# EAGLE design SMA-Q2 replacement board v2.3different (EAGLE 8.6.0)
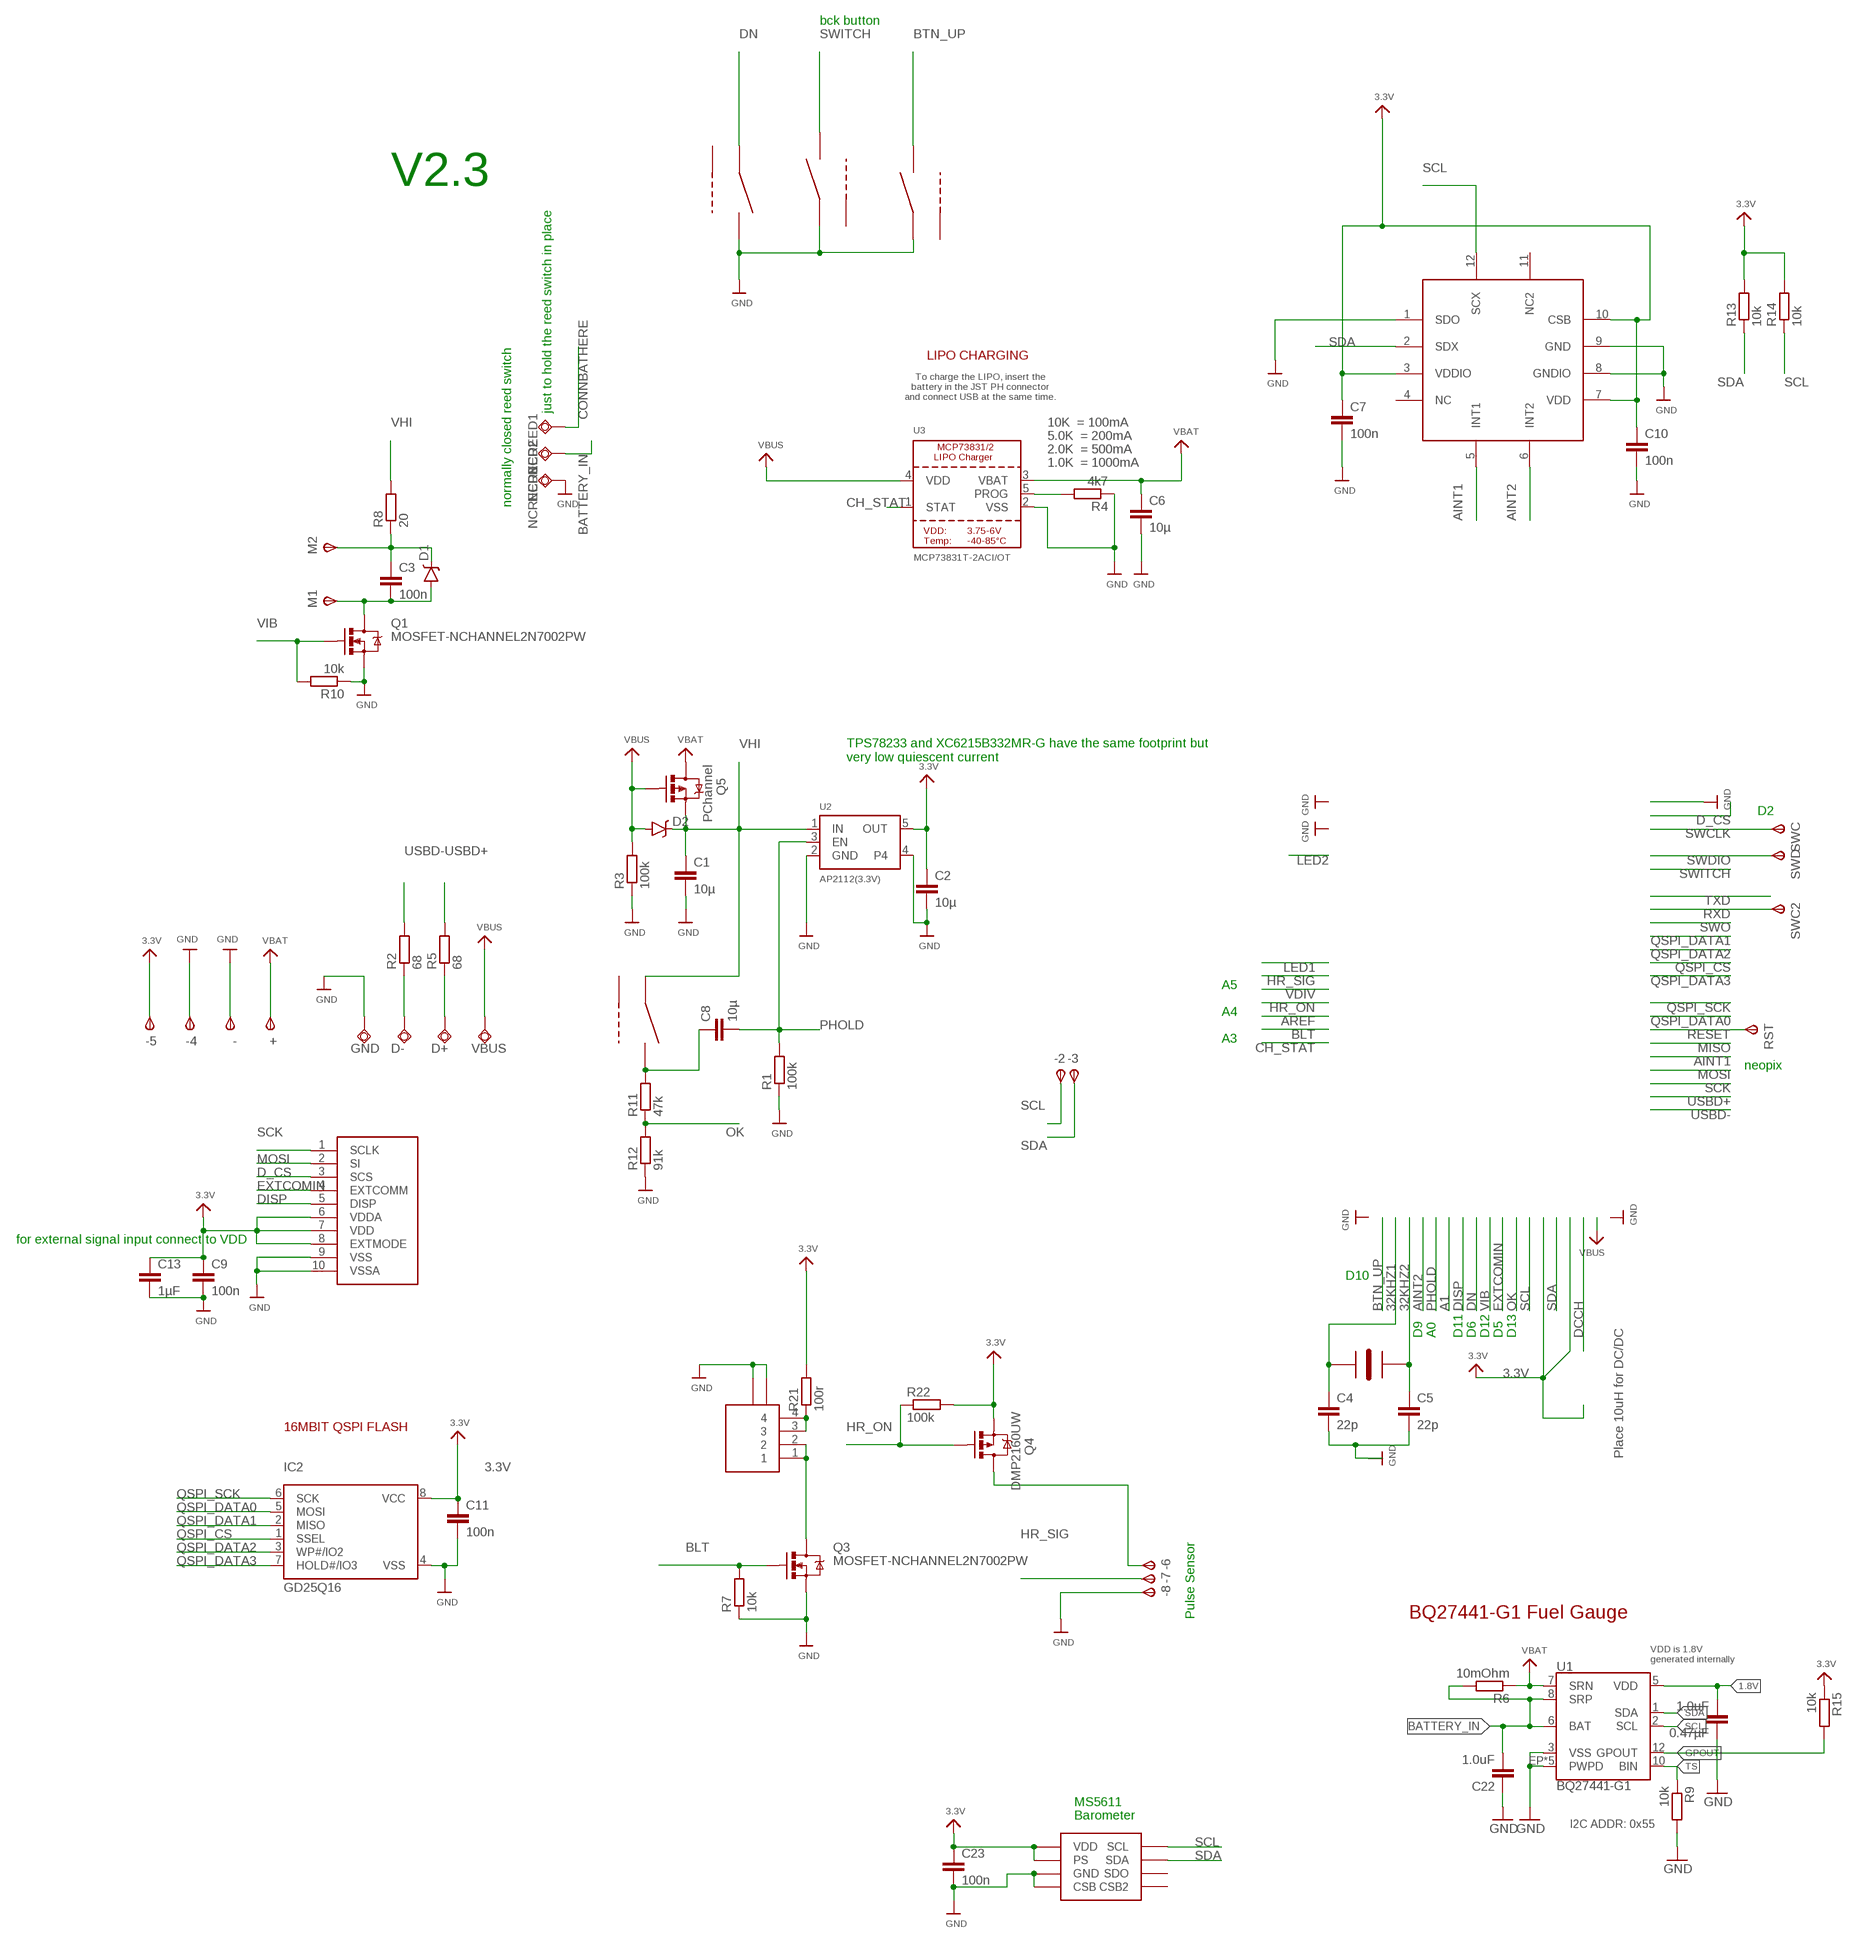
[diagram p0: schematic, sheet 1, part 1 of 2]
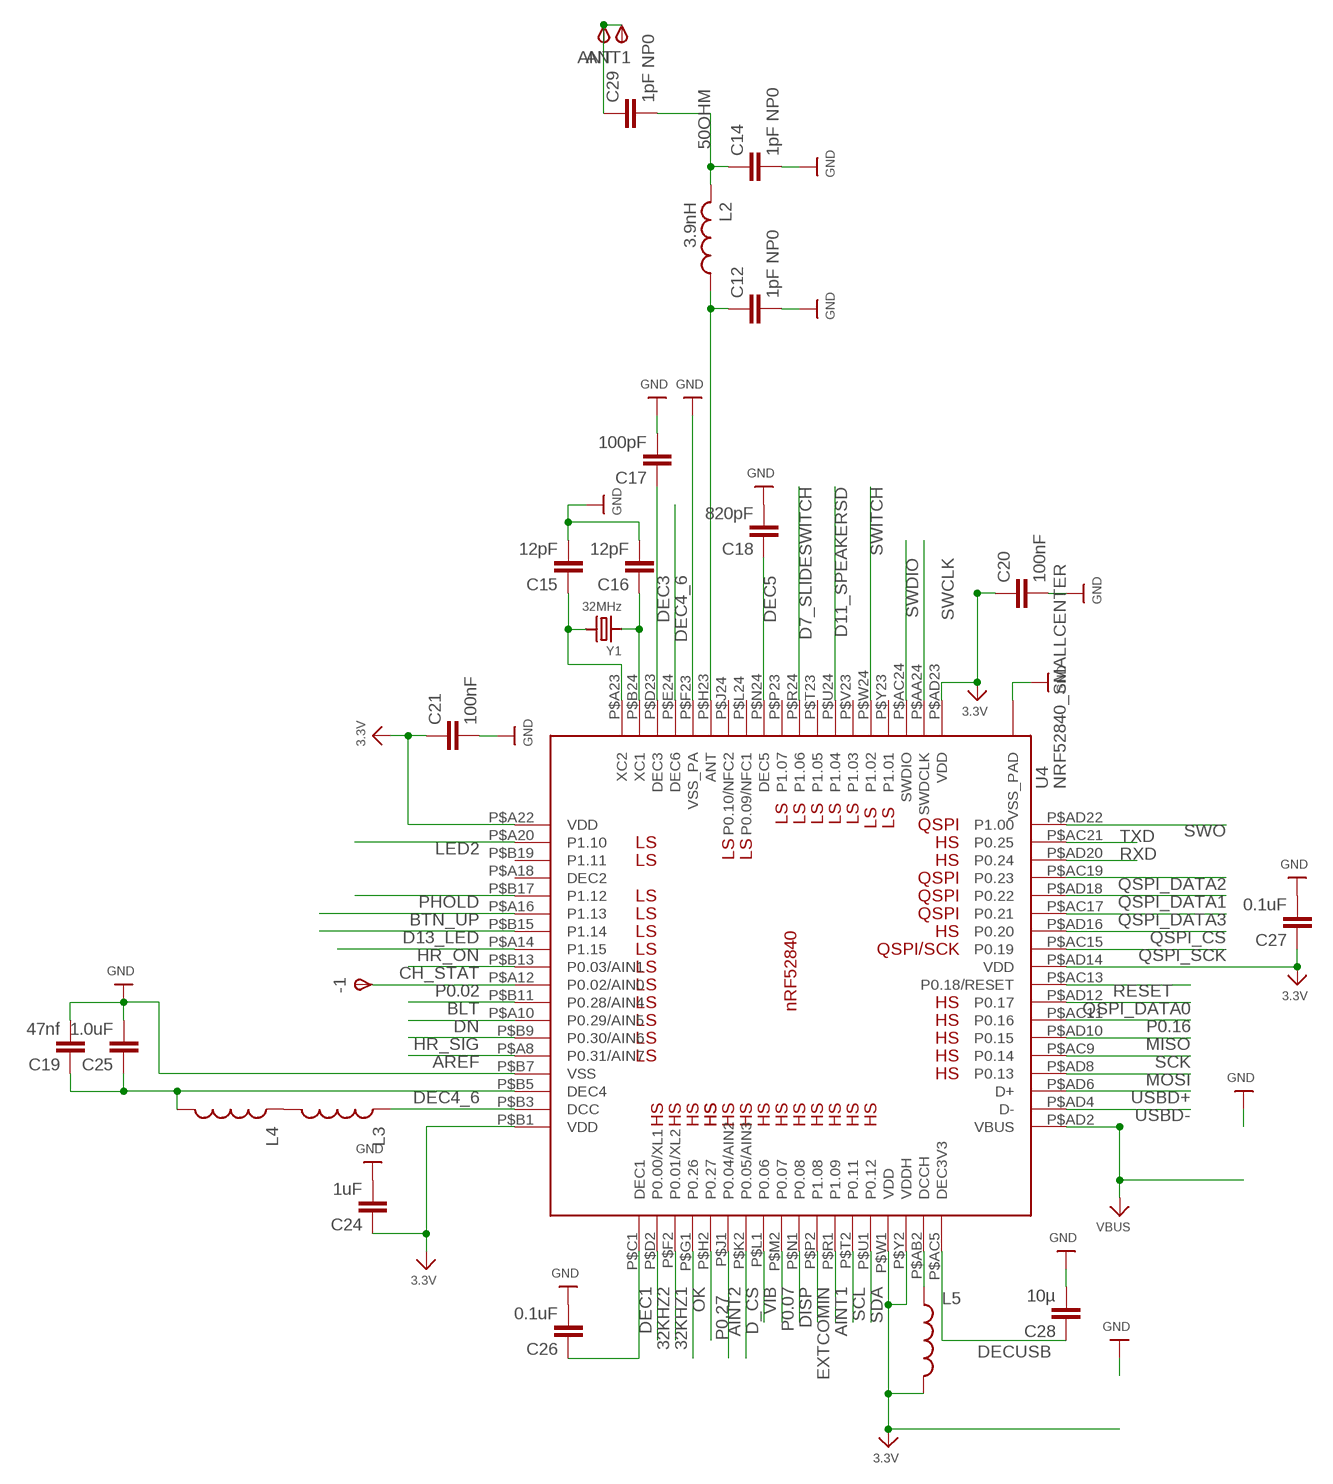
[diagram p1: schematic, sheet 1, part 2 of 2]

## Parts
0.47µF  1.0uF  CAPACITOR_0603_N  [RESC0603_N]
+  TPSTP09R  [TP09R]
-  TPSTP09R  [TP09R]
-1  TPSTP09R  [TP09R]
-2  TPSTP09R  [TP09R]
-3  TPSTP09R  [TP09R]
-4  TPSTP09R  [TP09R]
-5  TPSTP09R  [TP09R]
-6  TPSTP09R  [TP09R]
-7  TPSTP09R  [TP09R]
-8  TPSTP09R  [TP09R]
ANT  TPSTP19SQ  [TP19SQ]
ANT1  TPSTP19SQ  [TP19SQ]
C1  10µ  C-EUC0603  [C0603]
C2  10µ  C-EUC0603  [C0603]
C3  100n  C-EUC0402  [C0402]
C4  22p  C-EUC0402  [C0402]
C5  22p  C-EUC0402  [C0402]
C6  10µ  C-EUC0603  [C0603]
C7  100n  C-EUC0402  [C0402]
C8  10µ  C-EUC0603  [C0603]
C9  100n  C-EUC0402  [C0402]
C10  100n  C-EUC0402  [C0402]
C11  100n  C-EUC0402  [C0402]
C12  1pF NP0  CAPACITOR_0402_N  [RESC0402_N]
C13  1µF  C-EUC0402  [C0402]
C14  1pF NP0  CAPACITOR_0402_N  [RESC0402_N]
C15  12pF  CAPACITOR_0402_N  [RESC0402_N]
C16  12pF  CAPACITOR_0402_N  [RESC0402_N]
C17  100pF  CAPACITOR_0402_N  [RESC0402_N]
C18  820pF  CAPACITOR_0402_N  [RESC0402_N]
C19  47nf  CAPACITOR_0603_N  [RESC0603_N]
C20  100nF  CAPACITOR_0402_N  [RESC0402_N]
C21  100nF  CAPACITOR_0402_N  [RESC0402_N]
C22  1.0uF  CAPACITOR_0603_N  [RESC0603_N]
C23  100n  C-EUC0402  [C0402]
C24  1uF  CAPACITOR_0603_N  [RESC0603_N]
C25  1.0uF  CAPACITOR_0603_N  [RESC0603_N]
C26  0.1uF  CAPACITOR_0603_N  [RESC0603_N]
C27  0.1uF  CAPACITOR_0402_N  [RESC0402_N]
C28  10µ  C-EUC0603  [C0603]
C29  1pF NP0  CAPACITOR_0402_N  [RESC0402_N]
D1  BAT20J  DIODE-SCHOTTKY-BAT20J  [SOD-323]
D2  BAT20J  DIODE-SCHOTTKY-BAT20J  [SOD-323]
D+  TPSQTP20R  [TP20R]
D-  TPSQTP20R  [TP20R]
DWN  LS12T2  [LS12T2]
DWN1  LS12T2  [LS12T2]
DWN2  LS12T2  [LS12T2]
DWN3  LS12T2  [LS12T2]
GND  TPSQTP20R  [TP20R]
IC2  GD25Q16  SPIFLASH_8PINUX  [USON8]
L2  3.9nH  INDUCTOR_0402_N  [RESC0402_N]
L3  INDUCTOR30OHM,1.8A  [0603]
L4  INDUCTOR0402  [C0402]
L5  INDUCTOR30OHM,1.8A  [0603]
M1  TPSTP09R  [TP09R]
M2  TPSTP09R  [TP09R]
NCREED1  TPSQTP20R  [TP20R]
NCREED2  TPSQTP20R  [TP20R]
NCREED3  TPSQTP20R  [TP20R]
Q1  MOSFET-NCHANNEL2N7002PW  [SOT323]
Q3  MOSFET-NCHANNEL2N7002PW  [SOT323]
Q4  DMP2160UW  MOSFET-P-CHANNEL-DMP2160UW  [SOT323]
Q5  PChannel  MOSFET-P-CHANNEL-DMP2160UW  [SOT323]
R1  100k  R-EU_R0402  [R0402]
R2  68  R-EU_R0402  [R0402]
R3  100k  R-EU_R0402  [R0402]
R4  4k7  R-EU_R0402  [R0402]
R5  68  R-EU_R0402  [R0402]
R6  10mOhm  R-EU_R0402  [R0402]
R7  10k  R-EU_R0402  [R0402]
R8  20  R-EU_R0402  [R0402]
R9  10k  R-EU_R0402  [R0402]
R10  10k  R-EU_R0402  [R0402]
R11  47k  R-EU_R0402  [R0402]
R12  91k  R-EU_R0402  [R0402]
R13  10k  R-EU_R0402  [R0402]
R14  10k  R-EU_R0402  [R0402]
R15  10k  R-EU_R0402  [R0402]
R21  100r  R-EU_R0402  [R0402]
R22  100k  R-EU_R0402  [R0402]
RST  TPSTP09R  [TP09R]
SWC  TPSTP09R  [TP09R]
SWC2  TPSTP09R  [TP09R]
SWD  TPSTP09R  [TP09R]
U1  BQ27441-G1  [PDSO-N12]
U2  AP2112(3.3V)  VREG_SOT23-5  [SOT23-5]
U3  MCP73831T-2ACI/OT  MCP73831/2  [SOT23-5]
U4  NRF52840_SMALLCENTER  [AQFN50P700X800X85_HS-74N_SMALLCENTER]
U$2  SHARP_MEM_DISP  [Y5BW]
U$6  Y5B-4PIN  [Y5B-4PIN]
U$7  BMA400  [BMA400]
U$45  MC5611  [MS5611]
U$81  ECX-1210  [ECX-1210]
VBUS  TPSQTP20R  [TP20R]
Y1  32MHz  CRYSTAL2.5X2.0  [CRYSTAL_2.5X2]

## Nets
1.8V: 0.47µF.2 U1.5(VDD)
3.3V [power]: -5.TP(PP) C2.1 C7.1 C9.1 C10.1 C11.1 C13.1 C20.1 C21.1 C23.1 C24.1 C27.1 IC2.8(VCC) L5.2 Q4.2(S) R13.2 R14.2 R15.1 R21.2 R22.2 U2.5(OUT) U4.P$A22(VDD) U4.P$AD14(VDD) U4.P$AD23(VDD) U4.P$B1(VDD) U4.P$W1(VDD) U4.P$Y2(VDDH) U$2.6(VDDA) U$2.7(VDD) U$2.8(EXTMODE) U$7.3(VDDIO) U$7.7(VDD) U$7.10(CSB) U$45.PS U$45.VDD
32KHZ1: C4.1 U4.P$F2(P0.01/XL2) U$81.P$1
32KHZ2: C5.1 U4.P$D2(P0.00/XL1) U$81.P$2
50OHM: C14.1 C29.2 L2.2
AINT1: U4.P$R1(P1.09) U$7.5(INT1)
AINT2: U4.P$J1(P0.04/AIN2) U$7.6(INT2)
AREF: U4.P$A8(P0.31/AIN7)
BATTERY_IN: C22.2 NCREED2.TP R6.2 U1.6(BAT) U1.8(SRP)
BLT: Q3.1(G) R7.2 U4.P$B11(P0.28/AIN4)
BTN_UP: DWN2.1 U4.P$A16(P1.13)
CH_STAT: U3.1(STAT) U4.P$B13(P0.03/AIN1)
CONNBATHERE: NCREED1.TP
D7_SLIDESWITCH: U4.P$R24(P1.06)
D11_SPEAKERSD: U4.P$U24(P1.04)
D13_LED: U4.P$B15(P1.14)
D_CS: U4.P$K2(P0.05/AIN3) U$2.3(SCS)
DEC1: C26.1 U4.P$C1(DEC1)
DEC3: C17.1 U4.P$D23(DEC3)
DEC4_6: C19.1 C25.1 L4.2 U4.P$B5(DEC4) U4.P$E24(DEC6)
DEC5: C18.1 U4.P$N24(DEC5)
DECUSB: C28.1 U4.P$AC5(DEC3V3)
DISP [power]: U4.P$N1(P0.08) U$2.5(DISP)
DN: DWN.2 U4.P$A10(P0.29/AIN5)
EXTCOMIN: U4.P$P2(P1.08) U$2.4(EXTCOMM)
GND: 0.47µF.1 -4.TP(PP) -8.TP(PP) -.TP(PP) C1.2 C2.2 C4.2 C5.2 C6.2 C7.2 C9.2 C10.2 C11.2 C12.2 C13.2 C14.2 C15.2 C16.2 C17.2 C18.2 C19.2 C20.2 C21.2 C22.1 C23.2 C24.2 C25.2 C26.2 C27.2 C28.2 DWN1.2 DWN2.2 DWN.1 GND.TP IC2.4(VSS) NCREED3.TP Q1.2(S) Q3.2(S) R1.1 R3.1 R4.1 R7.1 R9.2 R10.1 R12.1 U1.3(VSS) U1.EP1(PWPD) U1.EP2(PWPD) U1.EP3(PWPD) U1.EP4(PWPD) U1.EP(PWPD) U2.2(GND) U2.4 U3.2(VSS) U4.P$B7(VSS) U4.P$F23(VSS_PA) U4.THERMPAD(VSS_PAD) U$2.9(VSS) U$2.10(VSSA) U$6.H1 U$6.H2 U$7.1(SDO) U$7.8(GNDIO) U$7.9(GND) U$45.CSB U$45.GND
GPOUT: R15.2 U1.12(GPOUT)
HR_ON: Q4.1(G) R22.1 U4.P$A14(P1.15)
HR_SIG: -7.TP(PP) U4.P$B9(P0.30/AIN6)
LED2: U4.P$A20(P1.10)
MISO: U4.P$AD10(P0.15)
MOSI: U4.P$AD8(P0.13) U$2.2(SI)
N$1: Q3.3(D) U$6.1 U$6.2
N$2: C8.1 DWN3.1 R11.2
N$3: D-.TP R2.1
N$4: D+.TP R5.1
N$5: C12.1 L2.1 U4.P$H23(ANT)
N$6: L3.2 L4.1
N$7: L3.1 U4.P$B3(DCC)
N$8: L5.1 U4.P$AB2(DCCH)
N$9: R21.1 U$6.3 U$6.4
N$10: -6.TP(PP) Q4.3(D)
N$12: R4.2 U3.5(PROG)
N$13: C3.2 D1.A M1.TP(PP) Q1.3(D)
N$14: C3.1 D1.C M2.TP(PP) R8.1
N$22: C15.1 U4.P$A23(XC2) Y1.3
N$23: C16.1 U4.P$B24(XC1) Y1.1
OK: R11.1 R12.2 U4.P$G1(P0.26)
P0.02: -1.TP(PP) U4.P$A12(P0.02/AIN0)
P0.07: U4.P$M2(P0.07)
P0.16: U4.P$AC11(P0.16)
P0.27: U4.P$H2(P0.27)
PHOLD: C8.2 R1.2 U2.3(EN) U4.P$B17(P1.12)
QSPI_CS: IC2.1(SSEL) U4.P$AD16(P0.20)
QSPI_DATA0: IC2.5(MOSI) U4.P$AD12(P0.17)
QSPI_DATA1: IC2.2(MISO) U4.P$AD18(P0.22)
QSPI_DATA2: IC2.3(WP#/IO2) U4.P$AC19(P0.23)
QSPI_DATA3: IC2.7(HOLD#/IO3) U4.P$AC17(P0.21)
QSPI_SCK: IC2.6(SCK) U4.P$AC15(P0.19)
RESET: RST.TP(PP) U4.P$AC13(P0.18/RESET)
RF: ANT1.TP(PP) ANT.TP(PP) C29.1
RXD: SWC2.TP(PP) U4.P$AD20(P0.24)
SCK: U4.P$AC9(P0.14) U$2.1(SCLK)
SCL: -2.TP(PP) R14.1 U1.2(SCL) U4.P$T2(P0.11) U$7.12(SCX) U$45.SCL
SDA: -3.TP(PP) R13.1 U1.1(SDA) U4.P$U1(P0.12) U$7.2(SDX) U$45.SDA
SWCLK: SWC.TP(PP) U4.P$AA24(SWDCLK)
SWDIO: SWD.TP(PP) U4.P$AC24(SWDIO)
SWITCH: DWN1.1 U4.P$W24(P1.02)
SWO: U4.P$AD22(P1.00)
TS: R9.1 U1.10(BIN)
TXD: U4.P$AC21(P0.25)
USBD+: R5.2 U4.P$AD6(D+)
USBD-: R2.2 U4.P$AD4(D-)
VBAT [power]: +.TP(PP) C6.1 Q5.3(D) R6.1 U1.7(SRN) U3.3(VBAT)
VBUS [power]: D2.A Q5.1(G) R3.2 U3.4(VDD) U4.P$AD2(VBUS) VBUS.TP
VHI [power]: C1.1 D2.C DWN3.2 Q5.2(S) R8.2 U2.1(IN)
VIB: Q1.1(G) R10.2 U4.P$L1(P0.06)
Unconnected: DWN1.FRAME(FRM) DWN2.FRAME(FRM) DWN3.FRAME(FRM) DWN.FRAME(FRM) U4.P$A18(DEC2) U4.P$B19(P1.11) U4.P$J24(P0.10/NFC2) U4.P$L24(P0.09/NFC1) U4.P$P23(P1.07) U4.P$T23(P1.05) U4.P$V23(P1.03) U4.P$Y23(P1.01) U$7.4(NC) U$7.11(NC2) U$45.CSB2 U$45.SDO

## Notes on the sheet
- bck button
- V2.3
- LIPO CHARGING
- To charge the LIPO, insert the
  battery in the JST PH connector
  and connect USB at the same time.
- just to hold the reed switch in place
- 10K  = 100mA
- 5.0K  = 200mA
- 2.0K  = 500mA
- 1.0K  = 1000mA
- normally closed reed switch
- TPS78233 and XC6215B332MR-G have the same footprint but 
  very low quiescent current
- D2
- A5
- A4
- A3
- neopix
- for external signal input connect to VDD
- D10
- D9 | A0 | D11 | D6 | D12 | D5 | D13
- 16MBIT QSPI FLASH
- Place 10uH for DC/DC
- BQ27441-G1 Fuel Gauge
- Pulse Sensor
- VDD is 1.8V
  generated internally
- MS5611
- Barometer | I2C ADDR: 0x55

## Library data of the parts
0.47µF C12 C14-C22 C24-C27 C29 = Nordic_misc:CAPACITOR: Generic chip capacitor
+ - -1--8 ANT ANT1 M1 M2 RST SWC SWC2 SWD = testpad:TPS: TEST PIN
C1-C11 C13 C23 C28 = rcl:C-EU: CAPACITOR, European symbol
D1 D2 = SparkFun-DiscreteSemi:DIODE-SCHOTTKY: Schottky diodes in SFE's production catalog BAT20J 1A 23V 0.62Vf RB751 120mA 40V 0.37Vf PMEG4005EJ 0.5A 40V 0.42Vf MBRA140 1A 40V 0.5Vf B340A 3A 40V SMA; PROD_ID: DIO-11623
D+ D- GND NCREED1-NCREED3 VBUS = testpad:TPSQ: Test pad
DWN DWN1-DWN3 = LS12T2:LS12T2
IC2 = microbuilder:SPIFLASH_8PIN: SOIC8 SPI Flash Be careful with the size since SOIC8 flash comes in several 'widths' SOIC8 150 mil M25P16 - 16Mbit (2Mbit x 8) Serial Flash (75MHz SPI Bus), Supply: 2.7-3.6V Digikey: SOIC8 - M25P16-VMN6P-ND SOIC8 208 mil W25Q16BVSSIG - 16Mbit (2Mbit x 8) Serial Flash (104MHz SPI Bus), Supply: 2.7-3.6V Digikey: SOIC8 - W25Q16BVSSIG-ND
L2 = Nordic_misc:INDUCTOR: Generic chip inductor
L3 L5 = SparkFun-Passives:INDUCTOR: Inductors Basic Inductor/Choke - 0603 and 1206. Footprints are not proven and vary greatly between part numbers. INDUCTOR POWER 3.3UH 4.0A SMD 0.197" L x 0.197" W x 0.177" H (5.00mm x 5.00mm x 4.50mm); PROD_ID: RES-07859
L4 = SparkFun-Passives:INDUCTOR: Inductors Basic Inductor/Choke - 0603 and 1206. Footprints are not proven and vary greatly between part numbers. INDUCTOR POWER 3.3UH 4.0A SMD 0.197" L x 0.197" W x 0.177" H (5.00mm x 5.00mm x 4.50mm)
Q1 Q3 = SparkFun-DiscreteSemi:MOSFET-NCHANNEL: Common NMOSFET Parts MFG P/N Store ID Prod ID FDD8780 TRANS-09984 SI7820DN TRANS-11055 FDS6630A IC-08089 2N7002PW TRANS-11151 FQP30N06L COM-10213 TRANS-10060 BSS123LT1G TRANS-08345 BSS138 TRANS-00830 BS170 2N7000; PROD_ID: TRANS-11151
Q4 Q5 = TSEM_R2A:MOSFET-P-CHANNEL: MOSFET P Channel; FARNELL_OC: 1858672
R1-R15 R21 R22 = rcl:R-EU_: RESISTOR, European symbol
U1 = battery-management-temp:BQ27441-G1; PROD_ID: IC-13220
U2 = microbuilder:VREG_SOT23-5: SOT23-5 Fixed Voltage Regulators Part Current Out V Out V In V Dropout θJA (°C/W) TJ (°C) Digikey Part No. ADP121 150mA 3.3V 3.4-5.5V 0.09V @ 150mA -- -- ADP121-AUJZ33R7CT-ND ADP121 150mA 3.0V 3.1-5.5V 0.09V @ 150mA -- -- ADP121-AUJZ30R7CT-ND ADP122 300mA 3.3V 3.4-5.5V 0.085V @ 300mA -- -- ADP122AUJZ-3.3-R7CT-ND ADP1712 300mA 3.3V 3.5-5.5V 0.17V @ 300mA -- -- ADP1712AUJZ-3.3-R7TR-ND AP7311 (Low Cost) 150mA 3.3V 3.5-6V 0.15V @ 150mA -- -- AP7311-33WG-7DICT-ND LD39015M18R 150mA 1.8V 1.9V-5.5V 0.08V @ 100mA -- -- 497-6977-1-ND LP2985A-33DBVR 150mA 3.3V 3.3-16V 0.28V @ 150mA 206 150 296-18479-1-ND MCP1824T-3302E/OT 300mA 3.3V 3.5V-6V 0.2V @ 300mA -- -- MCP1824T-3302E/OTCT-ND MIC5205-2.5YM5 TR 150mA 2.5V 2.7-16V 0.165V @ 150mA -- -- 576-1257-2-ND MIC5205-3.0YM5 TR 150mA 3.0V 3.2V-16V 0.165V @ 150mA -- -- 576-1258-2-ND MIC5205-3.3YM5 TR 150mA 3.3V 3.5V-16V 0.165V @ 150mA -- -- 576-1259-2-ND TPS780330220 150mA 3.3V+2.2V 3.6-5.5V 250mV Max -- -- 296-23332-1-ND TDA3663/N1,135 100mA 3.3V 3.5-45V 0.18V @ 50mA -- -- 568-5343-1-ND Max operating temp can be calculated using θJA, TJ (max junction temperature), and power in watts. Set the "Maximum Ambient Temperature" until it reaches TJ ("Max Junction Temperature"), which is the absolute limit for safe use of the regulator: Heat Sink Temperature Calculator <http://www.daycounter.com/Calculators/Heat-Sink-Temperature-Calculator.phtml> For example, With 12V source into a 3.3V LP2985 and a 30mA load, we are dissipating (12V-3.3V) * 0.03A = 0.261W. With a θJA of 206 °C/W, a TJ of 150°C, and 261mW we can safely use the chip without a heat sink up to 75°C (=147.1°C Junction Temperature).
U3 = microbuilder:MCP73831/2: MCP73831/2 LIPO Charger VDD: 3.75 - 6V Temp -40 - 85°C Programmable Charge Rate: 15-500mA NOTE: STAT is a tri-state logic output on the MCP73831 and an open-drain output on the MCP73832. SOT23-5 with 4.2V output and tri-state logic on STAT = MCP73831T-2ACI/OT
U4 = microbuilder:NRF52840: nRF52840 Features Advanced Single chip 2.4 GHz multi-protocol SoC 32-bit ARM Cortex-M4F Processor 1.7v to 5.5v operation 1MB flash + 256kB RAM Bluetooth 5 support for long range and high throughput 802.15.4 radio support On-chip NFC PPI –Programmable Peripheral Interconnect Automated power management system with automatic power management of each peripheral Configurable I/O mapping for analog and digital I/O 48 x GPIO 1 x QSPI 4 x Master/Slave SPI 2 x Two-wire interface (I²C) I²S interface 2 x UART 4 x PWM USB 2.0 controller ARM TrustZone CryptoCell-310 Cryptographic and security module AES 128-bit ECB/CCM/AAR hardware accelerator Digital microphone interface (PDM) Quadrature decoder 12-bit ADC Low power comparator On-chip 50Ω balun On-air compatible with nRF52, nRF51 and nRF24 Series Applications Advanced high performance wearables Wearables for secure payments Virtual Reality/Augmented Reality systems Smart Home sensor networks Smart city sensor networks High performance HID controllers Internet of Things (IoT) sensor networks Smart door locks Smart lighting networks Connected white goods
U$2 = AYF531035:SHARP_MEM_DISP
U$6 = Y5B-4pin:Y5B-4PIN
U$7 = BMA400:BMA400
U$45 = MS5611:MC5611
U$81 = ECX-1210:ECX-1210
Y1 = microbuilder:CRYSTAL: Crystals HC49UP - Surface Mount Crystal 4.0MHz 18pF +/-30ppm Surface Mount Crystal [Digikey: 535-9857-1-ND] 12.0 MHz Surface Mount Crystal [Digikey: 535-9869-6-ND] 25.0 MHz Surface Mount Crystal [Digikey: 535-9078-1-ND] 2.5 x 2.0mm - MEMs SMT Crystal 16.0 MHz 10pF 20ppm 2.5 x 2.0mm Crystal [Digikey -40-85°C: 535-10923-1-ND] 3.2 x 2.5mm - MEMs SMT Crystal 12.0 MHz 8pF 15ppm 3.2 x 2.5mm Crystal [Digikey: -10-70°C: 644-1047-1-ND -40-125°C: 644-1128-1-ND] 40~85°C cheaper: 644-1173-6-ND 16.0 MHz 8pF 15ppm 3.2 x 2.5mm Crystal [Digikey: -10-70°C: 644-1049-1-ND -40-125°C: 644-1129-2-ND]-40~85°C cheaper: 644-1175-6-ND 16.0 MHz 10pF 10ppm 3.2 x 2.5mm Crystal [Digikey: 644-1100-1-ND] 27.12 MHz 18pF 30ppm 3.2 x 2.5mm Crystal [Digikey: 887-1424-1-ND] 27.12MHz 10pF 10ppm 3.2 x 2.5mm Crystal [Digikey: 887-1329-1-ND] 4.9 x 1.8mm - MEMs SMT Crystal 32.768 KHz 12.5pF 20ppm 4.9 x 1.8mm Crystal [Digikey: SE2415CT-ND] 8.0 x 3.8mm - Surface Mount Crystal 32.768kHz 12.5pF 20ppm -40°C-85°C [Digikey: 535-9166-2-ND] Cylinder 32.768KHz Cylinder Crystal (2x6mm body) [Ex. Digikey: 300-8341-2-ND]

## Net classes
1 power: width 0.254 mm

## Board
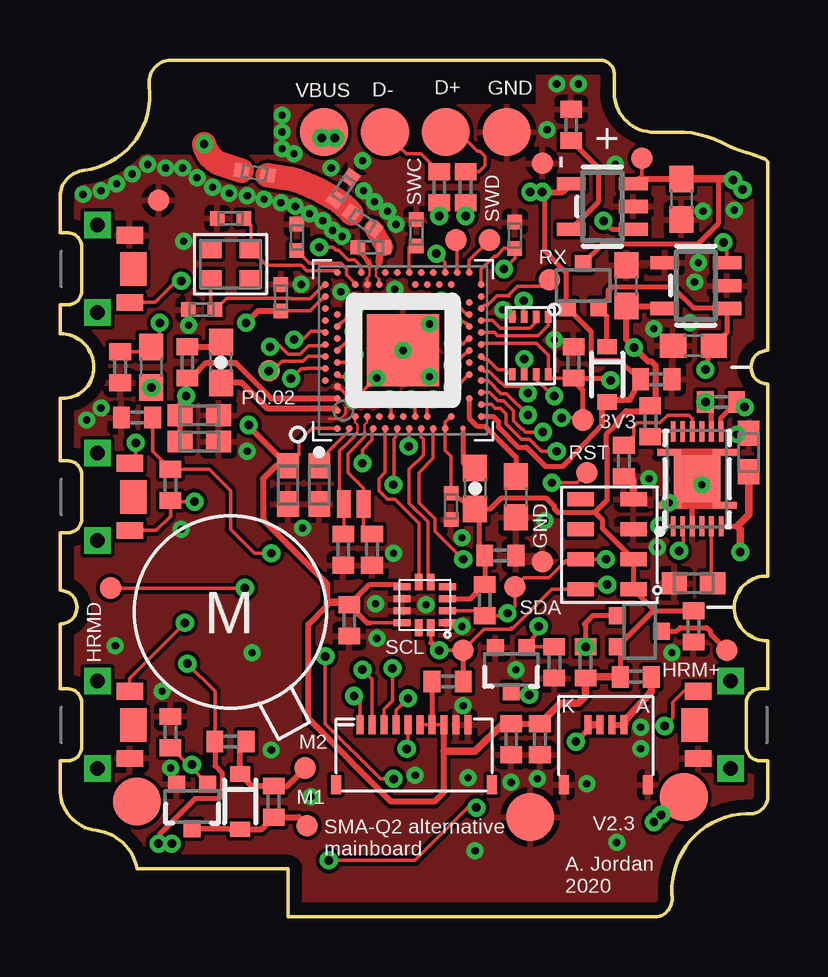
[diagram p2: board, top side]
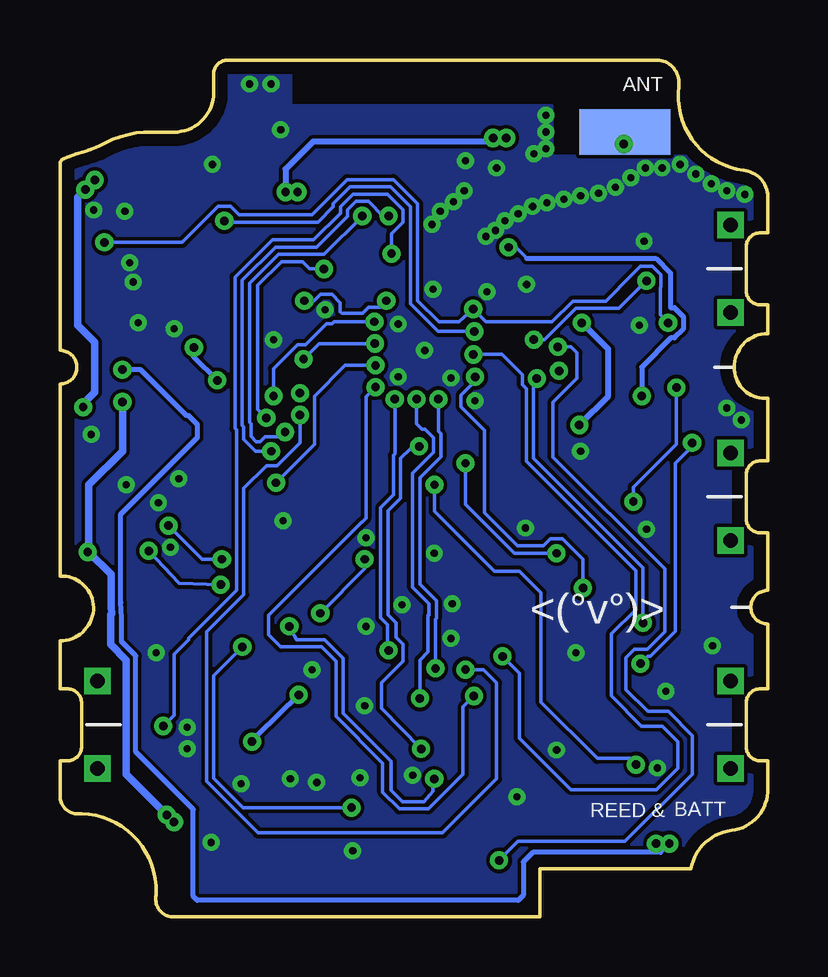
[diagram p3: board, bottom side, seen from below]

Size 29.52 x 35.7 mm. Coordinates in mm from the lower left corner, seen from the top.
Outline: 0.01,5.5 0.01,6.5 0.31,6.5 arc90 0.91,7.1 0.91,8.9 arc90 0.31,9.5 0.01,9.5 0.01,12.2 arc90 0.71,12.9 arc90 0.01,13.6 0.01,16 0.31,16 arc90 0.91,16.6 0.91,18.4 arc90 0.31,19 0.01,19 0.01,21.6 0.11,21.6 arc90 1.41,22.9 arc90 0.01,24.3 0.01,25.5 0.31,25.5 arc90 0.91,26.1 0.91,27.9 arc90 0.31,28.5 0.01,28.5 0.01,29.9 arc-90 1.01,31.1 arc90 3.71,34.6 3.71,34.7 arc-90 4.61,35.7 22.51,35.7 arc-90 23.11,35.1 23.11,34.5 arc90 24.61,32.7 26.01,32.7 arc-25 27.91,32.1 arc8 28.81,31.8 29.31,31.6 arc-90 29.51,31.3 29.51,23.6 arc90 28.81,22.9 arc90 29.51,22.2 29.51,14.2 arc90 28.11,12.9 arc90 29.51,11.5 29.51,9.5 29.21,9.5 arc90 28.61,8.9 28.61,7.1 arc90 29.21,6.5 29.51,6.5 29.51,4.9 arc-90 28.61,4.3 arc90 25.51,1 25.51,0.9 arc-90 24.91,0 9.51,0 9.51,2 3.21,2 arc73 1.51,3.6 arc-90 0.01,5.5
Copper layers (1*16): Top 0.035mm / dielectric 1.5mm / Bottom 0.035mm
Design rules "default *": minimum track width 6mil, minimum drill 0.35mm, track to track 6mil, track to pad 6mil, pad to pad 6mil, via to via 6mil, smd to smd 6mil, copper to edge 20mil, drill to drill 6mil, minimum pad ring 10mil, minimum via ring 8mil, stop-mask expansion 4mil, vias tented up to drill 20mil, thermal gap 10mil

### Footprints (pad centres in the part's own frame; a part is rotated, then mirrored left to right if it is on the bottom)
RESC0603_N = smd 1.05 x 0.9: 1 -0.8,0; 2 0.8,0
TP09R = smd 0.9 x 0.9: TP 0,0
TP19SQ = smd 1.9 x 1.9: TP 0,0
C0603 = smd 1.1 x 1: 1 -0.85,0; 2 0.85,0
C0402 = smd 0.7 x 0.9: 1 -0.65,0; 2 0.65,0
RESC0402_N = smd 0.6 x 0.6: 1 -0.55,0; 2 0.55,0
SOD-323 = smd 0.63 x 0.83: A 1.15,0; C -1.15,0
TP20R = smd 2 x 2: TP 0,0
LS12T2 = smd 1.1 x 0.7: 1 0,1.4; 2 0,-1.4 | smd 1.1 x 1.4: FRAME -0.15,0 | drill 0.6 pad 1.016 square: P$4 1.35,-1.825; P$5 1.35,1.825
USON8 = smd 0.5 x 0.275: 1 -1.2,0.75; 2 -1.2,0.25; 3 -1.2,-0.25; 4 -1.2,-0.75; 5 1.2,-0.75; 6 1.2,-0.25; 7 1.2,0.25; 8 1.2,0.75
0603 = smd 1.1 x 1: 1 -0.85,0; 2 0.85,0
SOT323 = smd 0.7 x 0.7: 1 -0.65,-0.925; 2 0.65,-0.925; 3 0,0.925
R0402 = smd 0.7 x 0.9: 1 -0.65,0; 2 0.65,0
PDSO-N12 = smd 0.2 x 0.85: 1 -1,-1.975; 2 -0.6,-1.975; 3 -0.2,-1.975; 4 0.2,-1.975; 5 0.6,-1.975; 6 1,-1.975; 7 1,1.975; 8 0.6,1.975; 9 0.2,1.975; 10 -0.2,1.975; 11 -0.6,1.975; 12 -1,1.975 | smd 1.95 x 1.95: EP 0,0 | smd 1 x 0.25: EP1 -1.15,1.1; EP2 -1.15,-1.1; EP3 1.15,-1.1; EP4 1.15,1.1
SOT23-5 = smd 0.55 x 1.2: 1 -0.95,-1.3; 2 0,-1.3; 3 0.95,-1.3; 4 0.95,1.3; 5 -0.95,1.3
AQFN50P700X800X85_HS-74N_SMALLCENTER = smd 0.3 x 0.3: P$A8 -1.25,3.25; P$A10 -0.75,3.25; P$A12 -0.25,3.25; P$A14 0.25,3.25; P$A16 0.75,3.25; P$A18 1.25,3.25; P$A20 1.75,3.25; P$A22 2.25,3.25; P$A23 2.75,3.25; P$AA24 3.25,-2.25; P$AC5 -2,-2.75; P$AC9 -1,-2.75; P$AC11 -0.5,-2.75; P$AC13 0,-2.75; P$AC15 0.5,-2.75; P$AC17 1,-2.75; P$AC19 1.5,-2.75; P$AC21 2,-2.75; P$AC24 3.25,-2.75; P$AD2 -2.75,-3.25; P$AD4 -2.25,-3.25; P$AD6 -1.75,-3.25; P$AD8 -1.25,-3.25; P$AD10 -0.75,-3.25; P$AD12 -0.25,-3.25; P$AD14 0.25,-3.25; P$AD16 0.75,-3.25; P$AD18 1.25,-3.25; P$AD20 1.75,-3.25; P$AD22 2.25,-3.25; P$AD23 2.75,-3.25; P$B1 -3.25,2.75; P$B3 -2.5,2.75; P$B5 -2,2.75; P$B7 -1.5,2.75; P$B9 -1,2.75; P$B11 -0.5,2.75; P$B13 0,2.75; P$B15 0.5,2.75; P$B17 1,2.75; P$B19 1.5,2.75; P$B24 3.25,2.75; P$C1 -3.25,2.25; P$D2 -2.75,2; P$D23 2.75,2; P$E24 3.25,1.75; P$F2 -2.75,1.5; P$F23 2.75,1.5; P$G1 -3.25,1.25; P$H2 -2.75,1; P$H23 2.75,1; P$J1 -3.25,0.75; P$J24 3.25,0.75; P$K2 -2.75,0.5; P$L1 -3.25,0.25; P$L24 3.25,0.25; P$M2 -2.75,0; P$N1 -3.25,-0.25; P$N24 3.25,-0.25; P$P2 -2.75,-0.5; P$P23 2.75,-0.5; P$R1 -3.25,-0.75; P$R24 3.25,-0.75; P$T2 -2.75,-1; P$T23 2.75,-1; P$U1 -3.25,-1.25; P$U24 3.25,-1.25; P$V23 2.75,-1.5; P$W1 -3.25,-1.75; P$W24 3.25,-1.75; P$Y2 -2.75,-2; P$Y23 2.75,-2 | smd 0.225 x 0.225: P$AB2 -3.25,-2.5 | smd 3 x 3: THERMPAD 0,0
Y5BW = smd 0.3 x 0.8: 1 -2.25,0; 2 -1.75,0; 3 -1.25,0; 4 -0.75,0; 5 -0.25,0; 6 0.25,0; 7 0.75,0; 8 1.25,0; 9 1.75,0; 10 2.25,0 | smd 0.4 x 0.8: P$11 -3.25,-2.5; P$12 3.25,-2.5
Y5B-4PIN = smd 0.3 x 0.8: 1 1,2.5; 2 1.5,2.5; 3 2,2.5; 4 2.5,2.5 | smd 0.4 x 0.8: H1 0,0; H2 3.5,0
BMA400 = smd 0.3 x 0.7: 1 0,-0.2; 2 0.5,-0.2; 3 1,-0.2; 4 1.5,-0.2; 7 1.5,1.7; 8 1,1.7; 9 0.5,1.7; 10 0,1.7 | smd 0.7 x 0.3: 5 1.7,0.5; 6 1.7,1; 11 -0.2,1; 12 -0.2,0.5
MS5611 = smd 1.1 x 0.6: CSB 0,0; CSB2 2.2,0; GND 0,1.25; PS 0,2.5; SCL 2.2,3.75; SDA 2.2,2.5; SDO 2.2,1.25; VDD 0,3.75
ECX-1210 = smd 0.575 x 1.14: P$1 0,0; P$2 0.825,0
CRYSTAL_2.5X2 = smd 0.9 x 0.75: 1 -0.825,-0.625; 2 0.825,-0.625; 3 0.825,0.625; 4 -0.825,0.625

### Placement (x,y rotation side)
0.47µF  26.41,13.9 0 top
+  24.26,31.6 270 top
-  20.11,31.4 270 top
-1  8.71,22.75 0 top
-2  16.81,11.1 0 top
-3  18.96,13.75 0 top
-4  20.11,14.8 0 top
-5  21.81,20.7 0 top
-6  27.81,11.1 0 top
-7  2.11,13.7 0 top
-8  4.11,29.85 0 top
ANT  5.01,32.7 0 bottom
ANT1  6.91,32.7 0 bottom
C1  26.41,23.8 180 top
C2  23.61,26.3 90 top
C3  8.91,4.8 270 top
C4  13.01,15.3 270 top
C5  11.81,15.3 270 top
C6  25.91,29.9 270 top
C7  12.06,12.35 270 top
C8  3.81,22.9 90 top
C9  18.81,7.4 270 top
C10  18.36,15.05 0 top
C11  21.41,23.1 90 top
C12  12.96,27.9 180 top
C13  20.01,7.4 270 top
C14  11.81,30.35 55 top
C15  5.91,25.3 180 top
C16  7.11,29.1 180 top
C17  9.88,28.31 90 top
C18  14.86,28.5 90 top
C19  5.81,19.8 0 top
C20  18.96,28.4 90 top
C21  9.21,25.8 90 top
C22  28.71,19.35 270 top
C23  26.41,12.1 270 top
C24  9.51,18 270 top
C25  5.81,20.9 0 top
C26  10.81,18 270 top
C27  16.31,17.1 270 top
C28  19.01,17.5 270 top
C29  8.11,31 350 top
D1  7.51,4.8 270 top
D2  22.81,22.6 270 top
D+  16.09,32.7 90 top
D-  13.55,32.7 90 top
DWN  2.91,8 180 top
DWN1  26.61,8 0 top
DWN2  2.91,27 180 top
DWN3  2.91,17.5 180 top
GND  18.63,32.7 0 top
IC2  19.61,23.8 270 top
L2  12.61,29 145 top
L3  6.71,23.1 90 top
L4  5.31,23.1 270 top
L5  17.31,17.85 270 top
M1  10.31,3.8 0 top
M2  10.21,6.2 0 top
NCREED1  3.21,4.8 0 top
NCREED2  26.01,5 0 top
NCREED3  19.61,4.15 0 top
Q1  5.51,4.6 180 top
Q3  18.81,10.3 180 top
Q4  24.16,11.9 270 top
Q5  21.81,26.3 0 top
R1  2.51,22.9 90 top
R2  15.81,30.4 270 top
R3  24.86,22.4 180 top
R4  21.31,33 270 top
R5  16.91,30.4 270 top
R6  27.56,21.45 180 top
R7  20.61,10.6 90 top
R8  7.11,7.3 180 top
R9  23.51,19 270 top
R10  4.61,7.7 270 top
R11  4.61,18 270 top
R12  3.21,20.8 0 top
R13  17.71,13.2 90 top
R14  16.16,9.8 180 top
R15  24.61,20.65 270 top
R21  24.01,10 180 top
R22  21.91,10.6 270 top
RST  21.96,18.5 0 top
SWC  16.51,28.2 0 top
SWC2  20.41,26.55 0 top
SWD  17.91,28.2 0 top
U1  26.56,18.25 0 top
U2  26.51,26.3 90 top
U3  22.61,29.6 90 top
U4  14.31,23.6 90 top
U$2  14.76,8 0 top
U$6  21.01,5.5 0 top
U$7  15.96,12.25 90 top
U$45  23.91,17.4 180 top
U$81  12.66,17.2 180 top
VBUS  11.01,32.7 90 top
Y1  7.11,27.2 180 top

### Tracks (layer width: path | path; a pad name or v marks a point on that pad's centre or on a via)
1.8V
  Top 0.15: U1.5 27.16,13.95 0.47µF.2
3.3V  (via drill 0.35)
  Top 0.15: U4.P$AD14 17.61,23.9 19.86,23.9 20.36,23.4 IC2.8 20.51,22.45 21.31,22.45 C11.1 | U4.P$A22 10.94,25.73 10.91,25.73 10.43,25.25 C21.1 | U4.P$Y2 16.06,20.6 U4.P$W1 16.06,19.45 16.31,19.2 C27.1 | U4.P$AD23 17.56,26.97 18.11,27.52 18.19,27.52 18.52,27.85 C20.1 18.96,27.44 v18.51,26.99 | 12.91,12.25 U$7.10 | -5.TP 21.72,20.79 v20.91,20.79
  Top 0.152: U$2.6 U$2.7 15.56,8 U$2.8 | C24.1 9.96,19.25 9.96,19.8 10.51,20.35 U4.P$B1
  Top 0.2: C11.1 22.86,22.45 v22.96,22.35
  Top 0.203: 17.51,14.75 17.46,14.95 | 17.46,14.95 C10.1 R13.2 17.11,13.25 U$7.3 | L5.2 17.46,16.5 17.46,14.95 | C27.1 L5.2 | U$7.7 14.16,13.85 12.91,13.85 C7.1 12.81,12.25 12.91,12.25 | R21.2 23.36,11.12 Q4.2 24.76,12.78 | R14.2 15.51,8.05 15.56,8 | L5.2 17.95,17 18.41,17.45 20.26,17.45 20.61,17.11 20.61,17 20.76,16.85 22.07,16.85 22.31,16.85 | -5.TP 21.81,21.95 21.31,22.45 | 24.76,12.78 24.79,12.75 C23.1 | 22.31,16.85 22.81,17.35 22.81,19.55 22.78,19.57 22.78,20.13 23.21,20.55 | 22.31,16.85 22.61,16.55 22.61,16.2 U$45.PS U$45.VDD 24.76,12.8 24.76,12.78
  Top 0.254: U$2.8 16.01,6.9 16.01,5.2 15.61,4.8 13.81,4.8 10.36,8.25 10.36,12.2 11.14,12.97 11.14,13.1 11.14,13.88 8.46,16.55 8.46,18.25 9.01,18.8 C24.1 7.87,20.44 v7.87,20.49 | C9.1 C13.1 | v7.76,24.75 8.26,25.25 C21.1 | U2.5 25.16,25.45 C2.1 23.61,24.05 v23.93,23.72 24.53,23.13 24.68,23.13 24.84,22.97 24.84,21.43 24.71,21.3 | 23.21,20.55 23.21,20.67 23.61,21.07 24.08,21.07 24.2,21.05 24.23,21.07 24.48,21.07 24.71,21.3 | R15.1 24.71,21.3
  Top 0.305: C13.1 20.86,8.9 21.61,8.9 21.91,9.2 R22.2 21.86,10 R21.2 | 16.01,6.9 17.31,6.9 18.46,8.05 C9.1 | 11.14,13.1 11.96,13.1 C7.1
  Bottom 0.15: v18.51,26.99 19.11,26.99 19.41,27.3 20.29,27.3 21.27,26.31 21.27,21.15 v20.91,20.79
  Bottom 0.2: v22.96,22.35 23.93,23.32 v23.93,23.72
  Bottom 0.254: v7.87,20.49 6.66,21.7 6.66,23.65 v7.76,24.75
32KHZ1
  Top 0.102: U4.P$F2 12.81,20.6 12.71,20.5 12.71,20.2
  Top 0.15: 12.71,20.05 12.71,20.2
  Top 0.152: C4.1 12.66,16.3 U$81.P$1 12.66,17.85 12.01,18.5 12.01,19.3 12.71,20 12.71,20.05
32KHZ2
  Top 0.102: 12.28,20.03 12.28,20.07 12.41,20.2 12.41,20.5 12.31,20.6 U4.P$D2
  Top 0.15: 12.28,20.03 11.99,19.74
  Top 0.152: C5.1 11.84,15.97 U$81.P$2 11.66,17.38 11.66,19.42 11.99,19.74
50OHM
  Top 1.016: L2.2 arc13 C14.1 arc6 10.46,30.45 arc16 9.31,30.8 C29.2
AINT1
  Top 0.152: U4.P$R1 15.06,19.99 15.15,19.9 15.15,19.24 14.56,18.65 14.56,17.23 15.34,16.45 15.34,14.07 U$7.5
AINT2
  Top 0.152: U4.P$J1 13.56,18.52 13.3,18.25 13.3,17.75 13.65,17.39 13.97,17.39 14.96,16.4 U$7.6
BATTERY_IN  (via drill 0.35)
  Top 0.15: v25.06,4.25 v24.76,3.95
  Top 0.203: U1.6 28.24,16.27 | U1.8 27.16,21.2 R6.2
  Top 0.305: NCREED2.TP 25.26,4.25 v25.06,4.25 | v28.36,15.2 28.36,16.15 28.24,16.27 28.71,16.75 C22.2
  Bottom 0.305: v25.06,4.25 26.76,5.95 26.76,10.7 27.41,11.35 27.41,12.4 27.4,12.42 27.4,12.57 27.4,12.59 27.36,12.62 27.37,12.91 27.37,14.26 28.31,15.2 | 28.31,15.2 v28.36,15.2 | R6.2 26.91,19.4 28.31,18 28.31,15.2
  other vias: 26.91,21.45
BLT  (via drill 0.35)
  Top 0.15: 19.71,11.47 Q3.1 19.96,11.97 v19.96,12.1 | U4.P$B11 11.95,23.1 v12.28,23.43 | v11.06,10.85 11.06,8.58
  Top 0.152: Q3.1 19.49,11.25 R7.2 | 11.06,8.58 11.06,8.05 13.36,5.75 v13.91,5.75
  Bottom 0.15: v19.96,12.1 19.66,11.55 18.49,11.55 17.71,10.78 17.71,8.47 15.71,6.48 15.71,5.28 15.24,4.8 14.34,4.8 13.96,5.23 13.96,5.75 v13.91,5.75 | v11.06,10.85 10.36,10.15 10.36,7.45 8.21,5.3 4.66,5.3 3.76,6.2 3.76,7.3 4.41,7.95 5.27,7.95 6.52,9.21 6.52,11.8 5.51,12.8 5.51,14.43 10.07,18.98 10.07,22.01 10.24,22.18 10.24,22.58 11.01,23.35 11.09,23.43 v12.28,23.43
BTN_UP  (via drill 0.35)
  Top 0.15: DWN2.1 3.96,25.6 4.86,26.5 v5.06,26.5 | v9.76,24.05 10.11,24.05 10.46,24.4 11.01,24.4 U4.P$A16
  Bottom 0.15: v5.06,26.5 6.21,25.36 8.01,25.36 9.32,24.05 v9.76,24.05
CH_STAT  (via drill 0.35)
  Top 0.15: U4.P$B13 11.68,23.72 11.72,23.72 12.24,24.25 v12.24,24.39
  Top 0.203: v22.66,29 23.01,28.65 U3.1
  Bottom 0.15: v22.66,29 22.61,28.95 18.76,28.95 18.12,29.59 18.12,29.7 17.41,30.41 15.74,30.41 14.9,29.58 14.9,25.54 13.75,24.39 v12.24,24.39
D_CS  (via drill 0.35)
  Top 0.15: U4.P$K2 13.81,21.5 v13.74,21.57 | v13.86,10.35 13.86,9 13.51,8.65 U$2.3
  Bottom 0.15: v13.74,21.57 13.74,20.23 13.64,20.13 13.64,19.17 14.51,18.3 14.51,13.85 13.83,13.17 13.83,12.43 13.86,12.4 v13.86,10.35
DEC1
  Top 0.152: U4.P$C1 12.06,20.25 10.81,19 C26.1
DEC3
  Top 0.15: U4.P$D23 12.29,26.37 12.29,26.39 11.94,26.74 11.94,27.01 11.72,27.23 10.42,27.23 C17.1
DEC4_6  (via drill 0.35)
  Top 0.15: U4.P$E24 12.56,27.1 12.29,27.37 12.02,27.37 11.62,27.77 11.52,27.77 11.39,27.9 v10.81,27.9 10.94,27.77
  Top 0.203: L4.2 5.26,22.4 v5.26,21.7 5.01,21.45 C25.1 C19.1 | 7.33,23.08 8.81,21.6
  Top 0.254: 7.33,23.08 6.1,23.08 5.47,22.45 L4.2 | 8.81,21.6 U4.P$B5
  Bottom 0.15: v10.81,27.9 10.51,27.9 10.05,27.43
  Bottom 0.203: 10.05,27.43 4.67,27.43 4.06,26.82 4.06,25.38 3.9,25.38 3.53,25.01 3.53,24.49 3.9,24.12 4.04,24.12 5.26,22.9 v5.26,21.7
DEC5
  Top 0.15: U4.P$N24 14.56,27.9 C18.1
DECUSB
  Top 0.203: U4.P$AC5 17.06,20.78 17.39,20.45 17.72,20.45 19.01,19.16 C28.1
DISP  (via drill 0.35)
  Top 0.15: U4.P$N1 14.56,19.52 v14.54,19.6 | U$2.5 14.51,6.9 v14.46,7
  Bottom 0.15: v14.54,19.6 14.91,19.5 15.31,19.1 15.31,17.45 15.84,16.92 15.84,12.58 15.51,12.25 15.51,11.65 15.21,11.35 15.21,10.66 16.11,9.75 16.11,8.7 v14.46,7
DN  (via drill 0.35)
  Top 0.15: v5.21,12.25 2.91,9.95 DWN.2 | U4.P$A10 10.27,22.85 10.26,22.84 10.05,22.84 v9.63,22.43
  Bottom 0.15: v5.21,12.25 5.21,14.55 9.77,19.11 9.77,22.29 v9.63,22.43
EXTCOMIN  (via drill 0.35)
  Top 0.15: U4.P$P2 14.81,21.41 v14.65,21.57 | U$2.4 14.01,8.6 v14.51,9.1
  Bottom 0.15: 14.13,12.56 14.13,12.6 | 14.13,12.6 14.13,13.04 14.81,13.72 14.81,18.48 13.94,19.35 13.94,19.95 14.29,20.31 14.42,20.31 14.65,20.54 v14.65,21.57 | v14.51,9.1 14.51,10.7 14.16,11.05 14.16,12.57 14.13,12.6
GND  (via drill 0.3)
  Top 0.102: U4.P$F23 12.81,26.6 12.91,26.7 12.91,27.02 12.91,27.2 | v12.21,21.5 11.91,21.2 11.91,20.95 11.71,20.75 11.42,20.75 11.41,20.75 11.21,20.75
  Top 0.15: v18.46,25.3 18.71,25 IC2.4 | U4.P$B7 11.68,21.98 11.72,21.98 12.2,21.5 v12.21,21.5 U4.THERMPAD | U$7.1 16.36,12.05 v16.76,12.1 | 25.06,19.35 U1.EP1
  Top 0.203: 12.91,27.2 C12.2 | U1.3 26.36,17.35 26.26,17.45 26.26,17.95 26.49,18.18 | 26.49,18.18 v26.76,18 | U1.EP2 26.44,18.18 26.49,18.18 | U1.EP3 27.66,17.2 27.06,17.2 26.56,17.7 v26.76,18 | U1.EP4 26.96,19.35 26.56,18.95 v26.76,18 | U1.EP1 26.21,19.35 26.21,18.6 v26.76,18
  Top 0.305: 23.91,18.2 U$45.CSB
  other vias: 15.26,13 3.01,30.95 3.66,31.35 24.21,7.9 23.21,3.1 18.81,5.6 19.91,5.75 14.81,5.9 17.01,5.8 21.96,5.55 17.31,2.75 1.11,20.7 20.31,32.8 20.71,34.7 21.61,34.7 24.21,7 2.31,11.3 2.36,30.55 4.41,31.2 5.11,31.2 5.71,30.8 6.36,30.4 7.81,30.05 7.06,30.15 9.26,33.4 9.26,32.7 14.31,23.6 1.71,21.2 11.71,26.05 13.96,26.15 10.06,26.35 13.16,13.05 13.91,15.15 20.21,16.5 16.76,15.8 13.21,11.6 26.61,27.25 23.16,31.35 26.81,29.4 20.61,24.05 10.11,16.2 7.81,19.4 5.36,24.65 16.81,8.8 19.01,10.3 24.56,18.25 8.01,11 5.06,16.15 1.71,30.25 0.96,30.1 8.51,29.9 9.21,29.75 9.81,29.6 10.41,29.3 11.76,28.35 10.96,29 11.36,28.6 14.01,28.85 13.66,29.4 13.11,29.8 12.61,31.5 12.66,30.25 11.31,31.2 9.26,32 9.76,31.8 10.46,5 8.81,6.95 15.41,24.7 13.21,22.45 15.41,22.5 24.76,24.5 25.51,11 5.16,28.15 4.26,9.4 4.61,6.2 24.91,15.4 26.26,24.75 26.46,26.45 28.11,29.45 28.21,20.1 25.41,17.25
  pour Top: -1.19,-0.3 -1.19,31.7 8.96,31.7 8.96,33.8 19.91,33.8 19.91,36.1 30.11,36.1 30.11,-0.3
  pour Bottom: -1.69,31.7 9.01,31.7 9.01,33.8 19.91,33.8 19.91,36.1 31.61,36.1 31.61,-2.4 -1.69,-2.4
GPOUT
  Top 0.152: R15.2 24.84,20.23 U1.12
HR_ON  (via drill 0.35)
  Top 0.15: U4.P$A14 11.01,23.8 10.37,23.8 10.01,23.44 9.51,23.44 9.16,23.8 9.11,23.75 v8.76,23.75 | v11.21,2.35 14.81,2.35 17.06,4.6 17.31,4.6 v17.36,4.55
  Top 0.203: Q4.1 22.21,12.55 21.86,12.2 21.91,12.15 R22.1
  Bottom 0.15: v11.21,2.35 10.41,3.15 5.96,3.15 3.16,5.95 3.16,7.55 4.16,8.55 5.02,8.55 5.92,9.46 5.92,10.8 5.56,11.16 5.02,11.16 4.3,11.87 4.3,14.5 8.96,19.16 8.96,21.45 7.96,22.45 7.96,23.5 8.21,23.75 v8.76,23.75 | v17.36,4.55 21.88,4.55 23.11,5.78 23.11,10.05 R22.1
  other vias: 21.91,11.25
HR_SIG  (via drill 0.35)
  Top 0.15: U4.P$B9 11.66,22.5 v12.21,22.5 | -7.TP v7.71,13.7
  Bottom 0.15: v12.21,22.5 12.21,22.32 12.79,21.74 12.79,21.26 12.21,20.68 | 10.44,15.45 9.36,15.45 9.06,15.76 8.56,15.76 7.71,14.91 v7.71,13.7
  Bottom 0.152: 10.44,15.45 11.81,16.83 11.81,20.28 12.21,20.68
MISO  (via drill 0.35)
  Top 0.15: U4.P$AD10 17.68,22.73 17.89,22.73 18.36,22.26 18.4,22.26 18.55,22.1 19.23,22.1 v19.51,21.82
MOSI  (via drill 0.35)
  Top 0.15: U4.P$AD8 17.84,22.35 18.39,21.8 18.62,21.8 v19.51,20.91 | U$2.2 13.01,9.9 v12.61,10.3
  Bottom 0.15: 19.32,20.91 v19.51,20.91 19.51,19.74 20.46,18.79 20.91,18.79 21.86,17.85 21.86,13.43 23.41,11.87 23.41,5.65 21.26,3.5 13.56,3.5 11.31,5.75 11.31,9.75 11.86,10.3 v12.61,10.3
N$1  (via drill 0.35)
  Top 0.203: 22.21,8 v21.51,7.3
  Top 0.305: U$6.1 22.21,8 U$6.2 | v19.56,9.25 18.91,9.25 Q3.3
  Bottom 0.203: v21.51,7.3 21.26,7.6 v19.56,9.25
N$2  (via drill 0.35)
  Top 0.15: DWN3.1 4.01,16.1 4.61,16.7 4.61,17.3 | 4.61,17.3 R11.2 | v5.61,17.3 4.61,17.3
  Bottom 0.15: C8.1 3.81,19.7 5.61,17.9
  Bottom 0.152: v5.61,17.3 5.61,17.9
  other vias: 3.81,22.05
N$3
  Top 0.152: D-.TP 14.45,31.8 15.06,31.8 R2.1
N$4
  Top 0.152: D+.TP 16.61,32.7 17.41,31.9 17.51,31.9 17.71,31.7 17.71,31.3 17.46,31.05 R5.1
N$5
  Top 0.102: 13.31,26.57 13.18,26.69 13.18,27.01 13.21,27.03
  Top 0.15: U4.P$H23 13.31,26.57 | 13.21,27.03 13.31,27.3
  Top 0.305: 13.31,27.3 13.36,27.75
  Top 0.406: 13.36,27.75 C12.1
  Top 0.75: L2.1 C12.1
N$6
  Top 0.254: L4.1 6.51,23.75 L3.2
N$7
  Top 0.254: U4.P$B3 11.49,21.17 8.66,21.17 7.58,22.25 L3.1
N$8
  Top 0.203: U4.P$AB2 16.81,18.91 16.87,18.86 16.87,18.8 L5.1
N$9
  Top 0.254: U$6.3 U$6.4
  Top 0.305: U$6.4 23.55,8.04 23.55,8.17 24.66,9.38 R21.1
N$10
  Top 0.203: -6.TP 27.12,11.8 27.12,11.9 26.97,12.05 25.86,12.05 25.7,11.9 Q4.3
N$12
  Top 0.203: U3.5 22.46,29.8 22.46,31.2 R4.2
N$13
  Top 0.254: M1.TP 9.96,4.15 C3.2 8.41,3.65 D1.A 6.56,3.7 Q1.3
N$14
  Top 0.254: R8.1 7.51,7.05 D1.C 8.01,5.45 C3.1 9.46,5.45 M2.TP
N$22
  Top 0.15: Y1.3 6.29,25.48 C15.1 6.94,25.78 9.61,25.78 9.63,25.75 10.43,25.75 10.91,26.23 10.94,26.23 U4.P$A23
N$23
  Top 0.15: Y1.1 7.96,27.8 | 7.96,27.8 8.61,27.15 10.07,27.15 10.29,26.93 11.49,26.93 U4.P$B24 | C16.1 7.96,28.8 7.96,27.8
OK  (via drill 0.35)
  Top 0.15: R12.2 3.86,19.4 R11.1 6.21,18.65 7.11,17.75 7.11,16.15 8.11,15.15 v8.81,15.15
  Top 0.152: v12.61,18.9 12.61,19.47 13.01,19.87 13.01,20.3 U4.P$G1
  Bottom 0.15: v8.81,15.15 10.56,15.15
  Bottom 0.152: 10.56,15.15 12.61,17.2 v12.61,18.9
P0.02  (via drill 0.35)
  Top 0.15: U4.P$A12 10.35,23.35 10.14,23.14 9.25,23.14 8.91,22.8 8.76,22.8 -1.TP
  other vias: 8.71,22.75
PHOLD  (via drill 0.35)
  Top 0.15: U2.3 27.81,28.05 v27.66,28.1 | v12.29,25.32 11.94,25.03 11.94,24.94 11.72,24.72 11.68,24.72 U4.P$B17 | 2.86,23.5 R1.2 3.61,23.55 C8.2 4.16,24.1 v4.16,24.75
  Bottom 0.15: v27.66,28.1 24.42,28.1 22.91,29.61 22.41,29.61 22.06,29.25 19,29.25 17.54,30.71 15.61,30.71 14.6,29.7 14.6,25.67 13.72,24.79 12.87,24.79 v12.29,25.32 11.76,24.8 9,24.8 8.14,25.66 6.75,25.66 5.67,26.74 5.67,26.75 5.31,27.11 4.81,27.11 4.46,26.75 4.46,26.25 4.49,26.21 4.49,25.08 v4.16,24.75
QSPI_CS
  Top 0.15: U4.P$AD16 18.11,24.35 18.24,24.22 19.93,24.22 20.36,24.65 IC2.1
QSPI_DATA0
  Top 0.15: U4.P$AD12 17.68,23.23 17.81,23.23 18.25,22.79 18.57,22.79 18.76,22.6 IC2.5
QSPI_DATA1
  Top 0.15: U4.P$AD18 18.04,24.85 18.37,24.52 19.59,24.52 19.86,24.79 IC2.2
QSPI_DATA2  (via drill 0.35)
  Top 0.15: v15.91,25.67 16.14,25.67 16.41,25.4 16.66,25.4 16.96,25.1 U4.P$AC19 | v19.33,25.67 19.33,25.03 IC2.3
  Bottom 0.15: v15.91,25.67 16.18,25.4 16.66,25.4 16.91,25.15 17.76,25.15 17.83,25.22 17.83,25.59 18.17,25.93 18.65,25.93 18.91,25.67 v19.33,25.67
QSPI_DATA3  (via drill 0.35)
  Top 0.15: U4.P$AC17 16.94,24.72 16.91,24.72 16.83,24.79 v16.4,24.79 | v20.61,21.7 19.86,22.35 IC2.7
  Bottom 0.15: v16.4,24.79 18.1,24.79 18.17,24.72 18.39,24.72 19.27,23.84 19.61,23.84 20.61,22.84 v20.61,21.7
QSPI_SCK  (via drill 0.35)
  Top 0.15: IC2.6 v19.36,23.24 | U4.P$AC15 16.94,23.98 16.91,23.98 16.81,23.89 v16.38,23.89
  Bottom 0.15: v16.38,23.89 18.71,23.89 v19.36,23.24
RESET  (via drill 0.35)
  Top 0.15: U4.P$AC13 16.94,23.48 16.91,23.48 16.4,22.98 v16.36,22.98 | RST.TP 21.55,18.09 v20.51,18.09
  Bottom 0.15: v20.51,18.09 18.91,19.69 18.91,21.7 17.63,22.98 v16.36,22.98
RF  (via drill 0.35)
  Top 1.016: v6.01,32.2 arc61 6.76,31.35 C29.1
  Bottom 0.15: ANT1.TP ANT.TP
  Bottom 0.7: v6.01,32.2 ANT.TP
RXD
  Top 0.15: U4.P$AD20 17.68,25.47 17.81,25.47 18.22,25.88 18.7,25.88 18.72,25.86 18.72,25.92 19.08,26.27 20.14,26.27 SWC2.TP
SCK  (via drill 0.35)
  Top 0.15: U$2.1 12.51,8.95 v12.26,9.2 | U4.P$AC9 16.53,22.07 v16.36,22.07
  Bottom 0.15: v16.36,22.07 16.76,21.67 16.76,16.6 16.93,16.43 16.95,16.43 20.81,12.57 20.81,11.75 20.31,11.25 18.61,11.25 18.01,10.65 18.01,8.35 16.06,6.4 16.06,5.2 15.36,4.5 14.16,4.5 12.71,5.95 12.71,8.75 v12.26,9.2
SCL  (via drill 0.35)
  Top 0.15: U4.P$T2 15.31,21.32 v15.56,21.57 | 15.46,11.4 U$7.12 | v15.81,11.1 -2.TP 17.68,11.97 18.76,11.97 | 18.76,11.97 18.84,11.97 | 18.76,11.97 18.83,12.04 18.91,12.04 20.52,13.65 U$45.SCL | U1.2 25.99,16.1 25.99,15.23 v25.81,15.25
  Top 0.203: v15.81,11.1 15.51,11.4 15.46,11.4 | -2.TP R14.1 | U$45.SCL 21.9,13.84 v22.81,13.84
  Bottom 0.15: v15.56,21.57 15.56,19.28 15.61,19.23 15.61,17.57 16.14,17.05 16.14,12.46 15.86,12.17 15.86,11.05 v15.81,11.1 | v25.81,15.25 24.55,13.89 v22.81,13.84
SDA  (via drill 0.35)
  Top 0.15: U$7.2 17.51,12.75 R13.1 18.56,12.55 v18.66,12.65 18.96,12.95 -3.TP 19.33,14.12 20.39,14.12 21.06,14.79 | U4.P$U1 15.56,19.1 14.96,18.5 14.96,17.26 15.64,16.58 15.64,16.07 v16.81,14.9 | U$45.SDA v22.77,14.9 | v24.99,16.3 25.54,16.3 U1.1
  Top 0.203: U$45.SDA 21.4,14.79 21.06,14.79
  Bottom 0.15: v18.66,12.65 16.81,14.5 v16.81,14.9 | v22.77,14.9 23.59,14.9 v24.99,16.3
SWCLK
  Top 0.15: U4.P$AA24 16.56,28.15 SWC.TP
SWDIO
  Top 0.15: U4.P$AC24 17.06,27.35 SWD.TP
SWITCH  (via drill 0.35)
  Top 0.15: 26.64,9.43 DWN1.1 | U4.P$W24 16.06,27.26 v15.69,27.63 | 26.61,9.55 DWN1.1 | v25.21,7.95 25.56,8.3 25.56,8.95 26.01,9.4 DWN1.1
  Bottom 0.15: v15.69,27.63 15.69,28.46 15.21,28.95 15.21,29.45 15.86,30.11 17.29,30.11 17.82,29.58 17.82,29.32 18.93,28.2 20.66,28.2 22.22,26.65 22.22,20.36 22.16,20.3 22.16,13.6 24.16,11.6 24.16,11.55 24.76,10.95 24.76,8.4 v25.21,7.95
TS
  Top 0.152: R9.1 23.93,20.07 23.93,20.45 24.07,20.58 25.01,20.58 25.33,20.9 26.21,20.9 26.36,20.75 U1.10
USBD+  (via drill 0.35)
  Top 0.15: v20.13,20.2 19.41,20.2 19.31,20.3 19.26,20.3 18.91,20.66 18.91,21.09 18.5,21.5 18.26,21.5 17.91,21.85 U4.P$AD6 | R5.2 v16.91,29.2
  Bottom 0.15: v16.91,29.2 18.51,27.6 20.41,27.6 21.61,26.4 21.61,20.61 21.56,20.55 21.56,20.02 21.34,19.8 21.16,19.8 20.96,20.01 20.33,20.01 v20.13,20.2
USBD-  (via drill 0.35)
  Top 0.15: U4.P$AD4 17.98,21.35 18.14,21.19 18.37,21.19 18.6,20.96 18.6,20.53 19.24,19.9 19.58,19.9 20.07,19.4 v20.71,19.4 | R2.2 v15.81,29.2
  Bottom 0.15: v15.81,29.2 16.06,29.2 16.66,29.81 17.16,29.81 17.52,29.45 17.52,29.19 18.81,27.9 20.54,27.9 21.91,26.52 21.91,20.48 21.86,20.43 21.86,19.9 21.36,19.4 v20.71,19.4
VBAT  (via drill 0.35)
  Top 0.152: U3.3 24.26,30.9 +.TP
  Top 0.203: Q5.3 22.64,28.05 26.61,28.05 27.46,28.9 27.46,30.75 | U1.7 27.56,20.8 R6.1
  Top 0.254: U3.3 24.11,30.75 C6.1
  Top 0.305: C6.1 27.46,30.75 28.01,30.75 v28.06,30.7 v28.46,30.3 | R6.1 28.42,21.24 v28.55,21.24
  Bottom 0.305: v28.06,30.7 28.77,29.99 28.77,24.65 28.07,23.95 28.07,21.85 28.55,21.38 v28.55,21.24
VBUS  (via drill 0.35)
  Top 0.2: 20.21,30.2 20.21,27.74 21.11,26.84 21.11,25.42 Q5.1 22.14,24.39 22.14,23.33 22.29,23.18 23.28,23.18 R3.2
  Top 0.203: U4.P$AD2 18.06,20.85 18.27,20.64 18.27,20.4 19.1,19.57 19.44,19.57 20.24,18.77 20.97,18.77 21.21,19 | 21.21,19 | 21.21,19 22.61,20.51
  Top 0.254: v20.11,30.2 20.21,30.2 20.96,30.2 U3.4 | v11.46,32.45 11.26,32.45 VBUS.TP 11.01,32.55 v10.91,32.45 | R3.2 23.76,21.55 22.91,21.55 D2.A 22.61,21.25 22.61,20.51
  Top 0.305: v19.61,30.2 v20.11,30.2
  Bottom 0.254: v20.11,30.2 20.11,31.15 18.96,32.3 11.61,32.3 v11.46,32.45
VHI  (via drill 0.35)
  Top 0.15: v3.16,19.75 3.16,19.15 DWN3.2 | v5.31,10.55 6.46,9.4 R8.2
  Top 0.2: Q5.2 22.81,25.02 D2.C
  Top 0.203: Q5.2 22.86,25.77 22.86,26.11 23.01,26.25 25.54,26.25 26.42,25.38 27.79,25.38 U2.1 27.81,24.35 C1.1 27.16,23.7 v26.91,22.8 | R8.2 6.46,6.28 6.77,5.98 6.77,5.07 6.62,4.92 5.63,4.92 4.16,3.45 4.16,3.1 | 4.16,3.1 v4.11,3.05 | v4.66,3.05 4.21,3.05 4.16,3.1
  Bottom 0.15: v3.16,19.75 3.01,19.75 3.86,18.9 3.86,11.89 4.9,10.85 5.01,10.85 v5.31,10.55
  Bottom 0.203: v4.11,3.05 4.48,2.69 9.8,2.69 10.2,2.28 10.2,0.9 10.41,0.69 23.8,0.69 23.96,0.85 23.96,4.47 26.36,6.87 26.36,10.87 26.95,11.46 26.95,12.47 26.97,13.1 26.97,16.78 23.78,19.97 23.78,20.51 24.15,20.88 24.24,20.88 26.16,22.8 v26.91,22.8
VIB  (via drill 0.35)
  Top 0.15: Q1.1 5.4,6.29 | 5.4,6.29 5.01,6.67 R10.2 | 5.4,6.29 5.45,6.29 v5.5,6.34
  Top 0.152: U4.P$L1 14.06,20.07 13.94,19.9 13.94,18.04 v13.9,18
  Bottom 0.15: v13.9,18 13.9,16.89 11.41,14.4 10.36,14.4 9.46,13.5 9.46,8.95 7.11,6.6 5.76,6.6 v5.5,6.34

### Text on the board
tPlace: SWC | SWD | RX | P0.02 | 3V3 | RST | GND | SDA | M | HRMD | SCL | HRM+ | K | A | V2.3 | SMA-Q2 alternative / mainboard | A. Jordan / 2020
bPlace: <(°v°)> | BATT | REED &